# EAGLE design rpi-adapter_V0 (EAGLE 9.2.2)
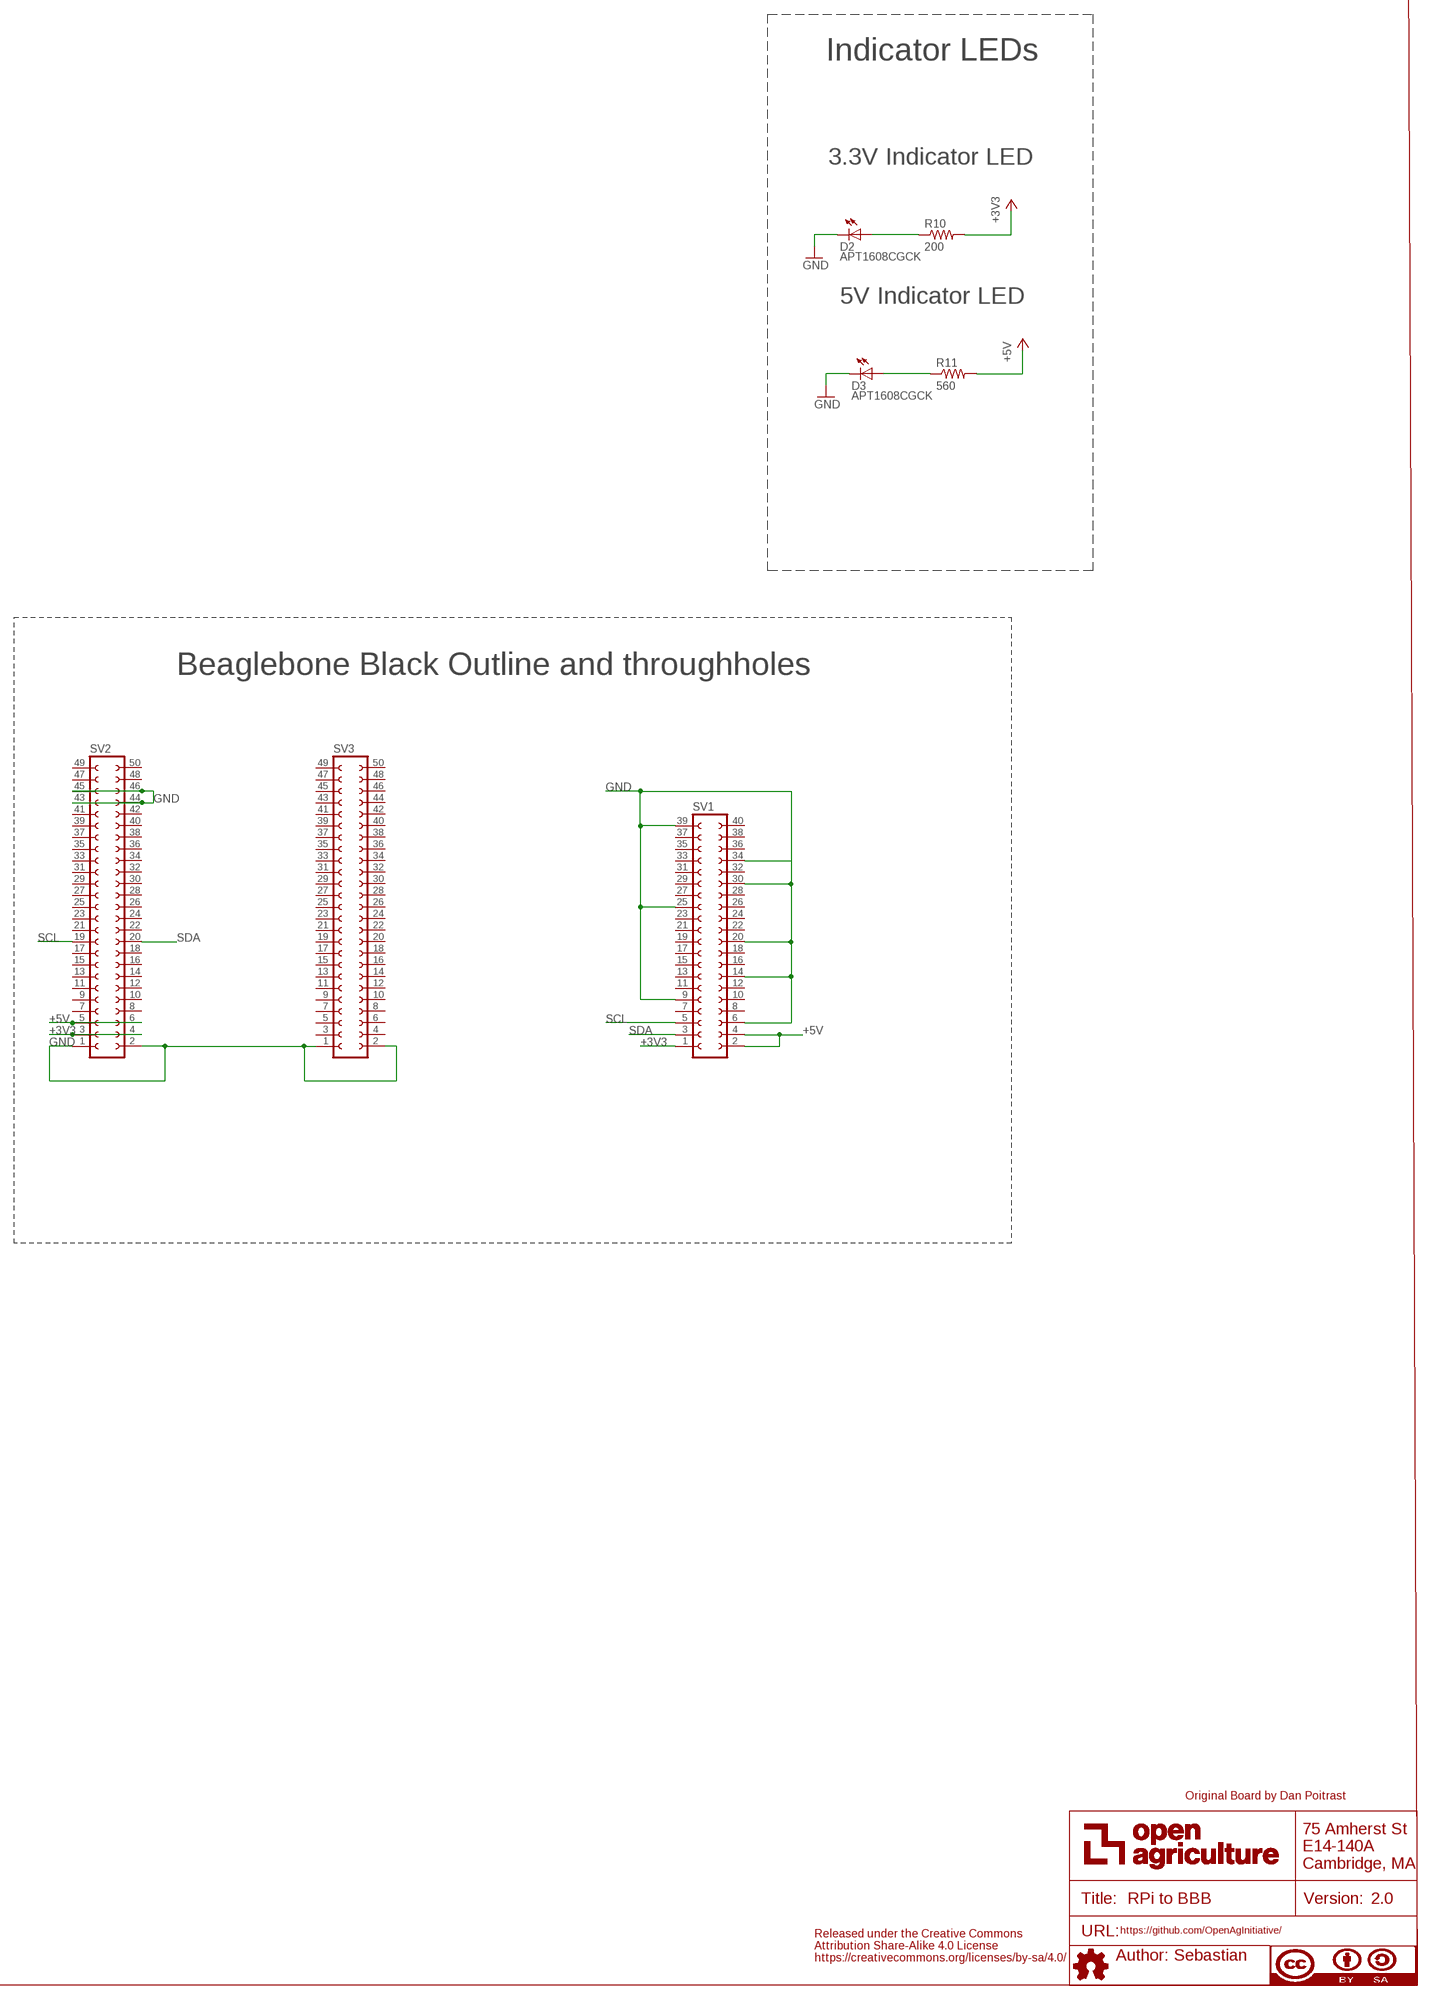
[diagram p0: schematic, sheet 1]

## Parts
ATTRIBUTES  DOCFIELD  [DOCFIELD]
D2  APT1608CGCK  [CHIPLED_0603]
D3  APT1608CGCK  [CHIPLED_0603]
R10  200  100OHM-RC0603JR-07100RL  [RC0603N]
R11  560  100OHM-RC0603JR-07100RL  [RC0603N]
SV1  FE20-2  [FE20-2]
SV2  FE25-2  [FE25-2]
SV3  FE25-2  [FE25-2]

## Nets
+3V3: R10.2 SV1.1 SV2.3 SV2.4
+5V: R11.2 SV1.2 SV1.4 SV2.5 SV2.6
GND: D2.C D3.C SV1.6 SV1.9 SV1.14 SV1.20 SV1.25 SV1.30 SV1.34 SV1.39 SV2.1 SV2.2 SV2.43 SV2.44 SV2.45 SV2.46 SV3.1 SV3.2
N$2: D3.A R11.1
N$12: D2.A R10.1
SCL: SV1.5 SV2.19
SDA: SV1.3 SV2.20
Unconnected: SV1.7 SV1.8 SV1.10 SV1.11 SV1.12 SV1.13 SV1.15 SV1.16 SV1.17 SV1.18 SV1.19 SV1.21 SV1.22 SV1.23 SV1.24 SV1.26 SV1.27 SV1.28 SV1.29 SV1.31 SV1.32 SV1.33 SV1.35 SV1.36 SV1.37 SV1.38 SV1.40 SV2.7 SV2.8 SV2.9 SV2.10 SV2.11 SV2.12 SV2.13 SV2.14 SV2.15 SV2.16 SV2.17 SV2.18 SV2.21 SV2.22 SV2.23 SV2.24 SV2.25 SV2.26 SV2.27 SV2.28 SV2.29 SV2.30 SV2.31 SV2.32 SV2.33 SV2.34 SV2.35 SV2.36 SV2.37 SV2.38 SV2.39 SV2.40 SV2.41 SV2.42 SV2.47 SV2.48 SV2.49 SV2.50 SV3.3 SV3.4 SV3.5 SV3.6 SV3.7 SV3.8 SV3.9 SV3.10 SV3.11 SV3.12 SV3.13 SV3.14 SV3.15 SV3.16 SV3.17 SV3.18 SV3.19 SV3.20 SV3.21 SV3.22 SV3.23 SV3.24 SV3.25 SV3.26 SV3.27 SV3.28 SV3.29 SV3.30 SV3.31 SV3.32 SV3.33 SV3.34 SV3.35 SV3.36 SV3.37 SV3.38 SV3.39 SV3.40 SV3.41 SV3.42 SV3.43 SV3.44 SV3.45 SV3.46 SV3.47 SV3.48 SV3.49 SV3.50

## Notes on the sheet
- Indicator LEDs
- 3.3V Indicator LED
- 5V Indicator LED
- Beaglebone Black Outline and throughholes
- Original Board by Dan Poitrast
- Released under the Creative Commons
  Attribution Share-Alike 4.0 License
  https://creativecommons.org/licenses/by-sa/4.0/

## Library data of the parts
ATTRIBUTES = openag-frames:DOCFIELD: DOCUMENT FIELD; AUTHOR: Sebastian; DESCRIPTION: RPi to BBB; TITLE: RPi to BBB; URL: https://github.com/OpenAgInitiative/; VER: 2.0
D2 D3 = openag-diodes:APT1608CGCK: Kingbright - APT1608CGCK - LED GREEN CLEAR 0603 SMD Description: Green 570nm LED Indication - Discrete 2.1V 0603 (1608 Metric) Technical Specifications: Color: Green Lens Color: Colorless Lens Transparency: Clear Millicandela Rating: 50mcd Lens Style/Size: Rectangle with Flat Top, 1.20mm x 0.80mm Voltage - Forward (Vf) (Typ): 2.1V Current - Test: 20mA Viewing Angle: 120° Mounting Type: Surface Mount Wavelength - Dominant: 570nm Wavelength - Peak: 574nm Package / Case: 0603 (1608 Metric) Supplier Device Package: Chip LED Size / Dimension: 1.60mm L x 0.80mm W Height (Max): 0.75mm Datasheet(s): APT1608CGCK <http://www.kingbrightusa.com/images/catalog/SPEC/APT1608CGCK.pdf> Vendor(s): Digikey: 754-1116-1-ND <https://www.digikey.com/product-detail/en/kingbright/APT1608CGCK/754-1116-1-ND/1747833#>; POPULATE: YES; VERIFIED: NO
R10 R11 = openag-resistors:100OHM-RC0603JR-07100RL: Yageo - RC0603JR-07100RL - RES SMD 100 OHM 5% 1/10W 0603 Description: 100 Ohms ±5% 0.1W, 1/10W Chip Resistor 0603 (1608 Metric) Moisture Resistant Thick Film Technical Specifications: Resistance: 100 Ohms Tolerance: ±5% Power (Watts): 0.1W, 1/10W Composition: Thick Film Features: Moisture Resistant Temperature Coefficient: ±100ppm/°C Operating Temperature: -55°C ~ 155°C Package / Case: 0603 (1608 Metric) Supplier Device Package: 0603 Size / Dimension: 0.063" L x 0.032" W (1.60mm x 0.80mm) Height - Seated (Max): 0.022" (0.55mm) Number of Terminations: 2 Datasheet(s): Thick Film Chip Resistor Intro <http://www.yageo.com.tw/exep/pages/download/literatures/PYu-R_INT-thick_7.pdf> Chip Resistor Marking <http://www.yageo.com/exep/pages/download/literatures/PYu-R_Marking_2.pdf> RC Series, L Datasheet <http://www.yageo.com/documents/recent/PYu-RC_Group_51_RoHS_L_8.pdf> Vendor(s): Digikey: 311-100GRCT-ND <https://www.digikey.com/product-detail/en/yageo/RC0603JR-07100RL/311-100GRCT-ND/729644>; POPULATE: YES; VALUE: 100 OHM; VERIFIED: NO
SV1 = con-lsta:FE20-2: FEMALE HEADER; OC_FARNELL: unknown; OC_NEWARK: unknown
SV2 SV3 = con-lsta:FE25-2: FEMALE HEADER; OC_FARNELL: unknown; OC_NEWARK: unknown

## Board
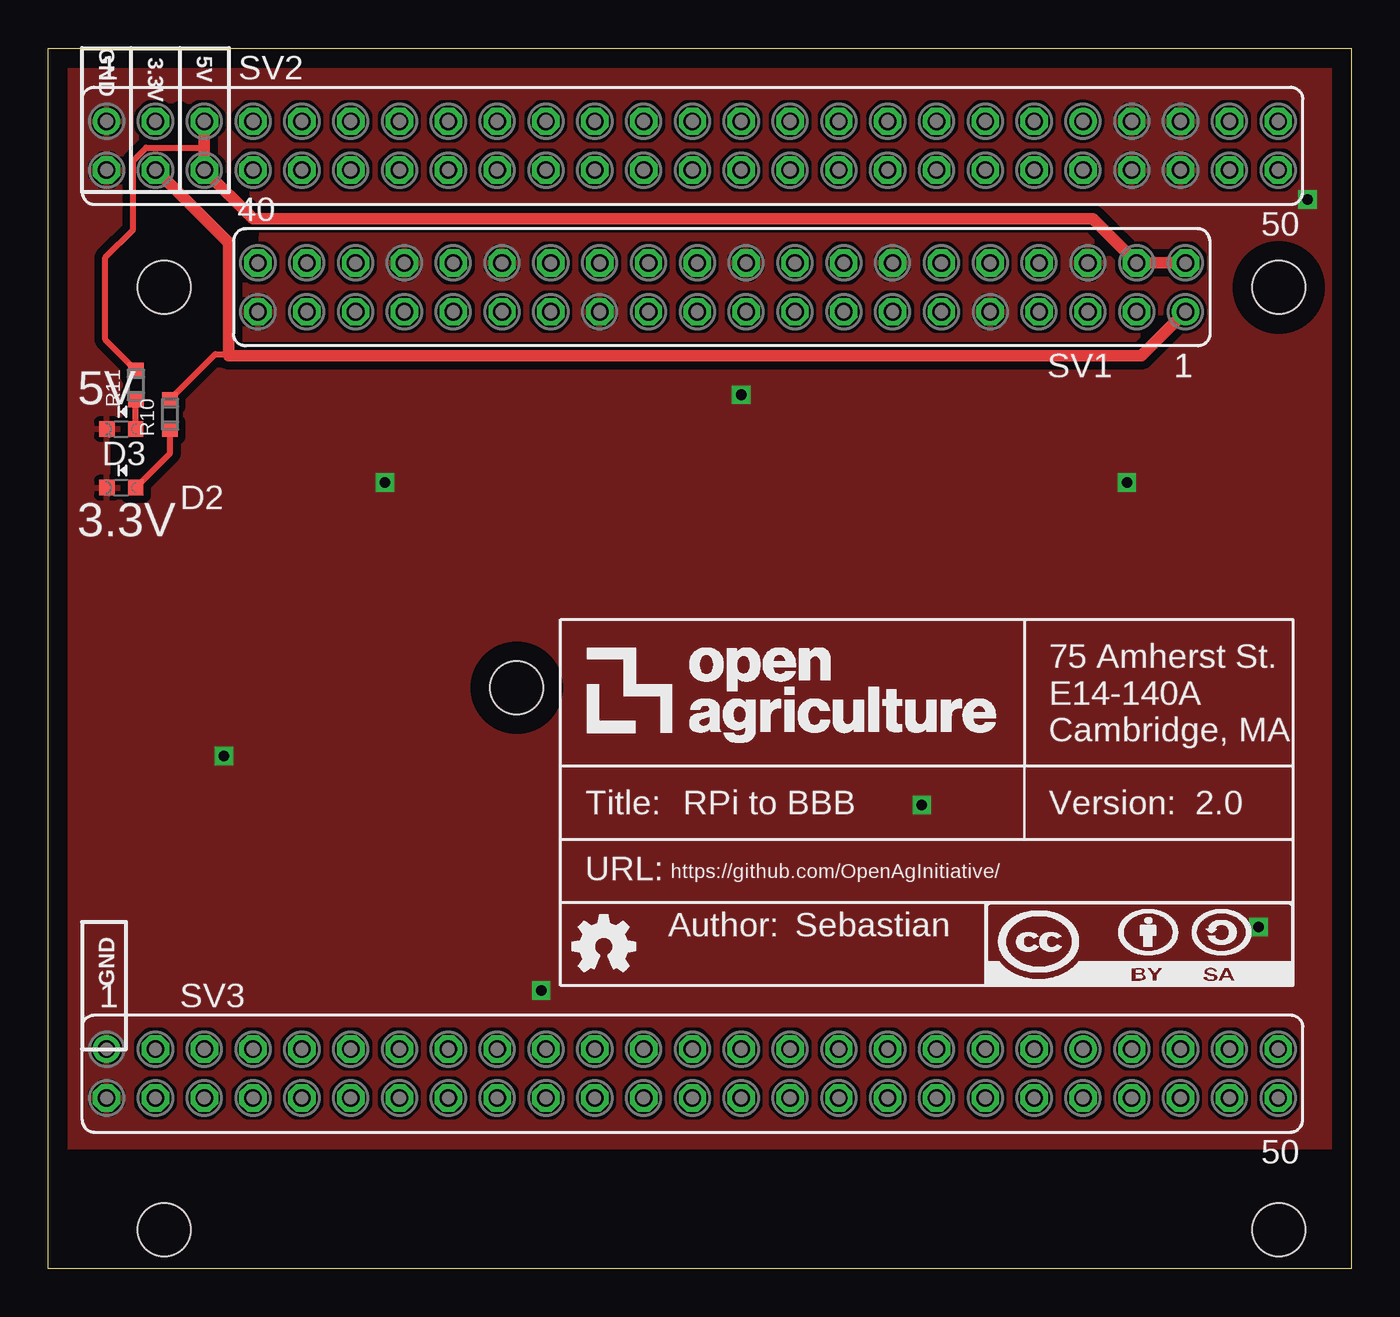
[diagram p1: board, top side]
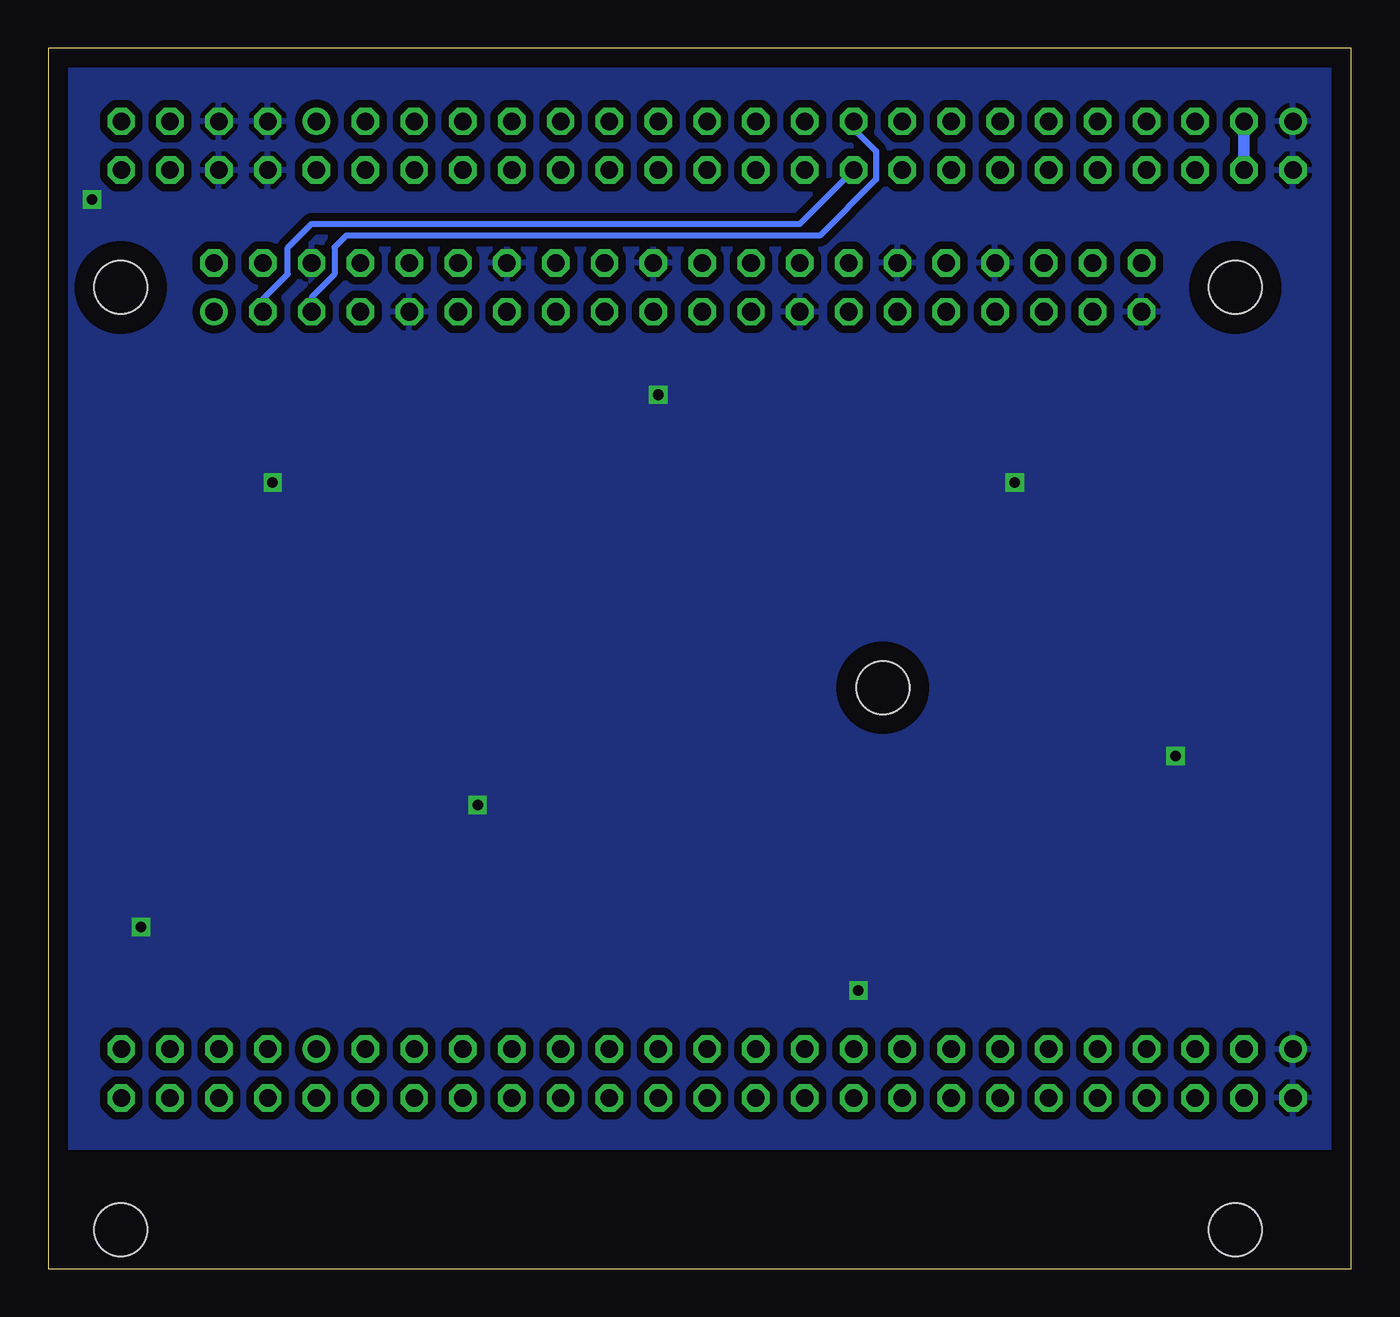
[diagram p2: board, bottom side, seen from below]

Size 67.82 x 63.5 mm. Coordinates in mm from the lower left corner, seen from the top.
Outline: 0,0 0,63.5 67.82,63.5 67.82,0 0,0
Copper layers (1*16): Top 0.035mm / dielectric 1.5mm / Bottom 0.035mm
Design rules "default *": minimum track width 6mil, minimum drill 0.35mm, track to track 12mil, track to pad 12mil, pad to pad 6mil, via to via 6mil, smd to smd 6mil, copper to edge 40mil, drill to drill 6mil, minimum pad ring 10mil, minimum via ring 8mil, stop-mask expansion 4mil, vias tented up to drill 25mil, thermal gap 10mil
Holes 2.77 mm at 6.05,51.05 64.03,51.05 6.05,2.03 64.03,2.03 24.38,30.23
tRestrict: 3 lines

### Footprints (pad centres in the part's own frame; a part is rotated, then mirrored left to right if it is on the bottom)
CHIPLED_0603 = smd 0.8 x 0.8: A 0,-0.75; C 0,0.75
RC0603N = smd 0.756 x 0.8: 1 -0.778,0; 2 0.778,0
FE20-2 = drill 0.914: 1 -24.13,1.27 | drill 0.914 octagon: 2 -24.13,-1.27; 3 -21.59,1.27; 4 -21.59,-1.27; 5 -19.05,1.27; 6 -19.05,-1.27; 7 -16.51,1.27; 8 -16.51,-1.27; 9 -13.97,1.27; 10 -13.97,-1.27; 11 -11.43,1.27; 12 -11.43,-1.27; 13 -8.89,1.27; 14 -8.89,-1.27; 15 -6.35,1.27; 16 -6.35,-1.27; 17 -3.81,1.27; 18 -3.81,-1.27; 19 -1.27,1.27; 20 -1.27,-1.27; 21 1.27,1.27; 22 1.27,-1.27; 23 3.81,1.27; 24 3.81,-1.27; 25 6.35,1.27; 26 6.35,-1.27; 27 8.89,1.27; 28 8.89,-1.27; 29 11.43,1.27; 30 11.43,-1.27; 31 13.97,1.27; 32 13.97,-1.27; 33 16.51,1.27; 34 16.51,-1.27; 35 19.05,1.27; 36 19.05,-1.27; 37 21.59,1.27; 38 21.59,-1.27; 39 24.13,1.27; 40 24.13,-1.27
FE25-2 = drill 0.914: 1 -30.48,1.27; 41 20.32,1.27 | drill 0.914 octagon: 2 -30.48,-1.27; 3 -27.94,1.27; 4 -27.94,-1.27; 5 -25.4,1.27; 6 -25.4,-1.27; 7 -22.86,1.27; 8 -22.86,-1.27; 9 -20.32,1.27; 10 -20.32,-1.27; 11 -17.78,1.27; 12 -17.78,-1.27; 13 -15.24,1.27; 14 -15.24,-1.27; 15 -12.7,1.27; 16 -12.7,-1.27; 17 -10.16,1.27; 18 -10.16,-1.27; 19 -7.62,1.27; 20 -7.62,-1.27; 21 -5.08,1.27; 22 -5.08,-1.27; 23 -2.54,1.27; 24 -2.54,-1.27; 25 0,1.27; 26 0,-1.27; 27 2.54,1.27; 28 2.54,-1.27; 29 5.08,1.27; 30 5.08,-1.27; 31 7.62,1.27; 32 7.62,-1.27; 33 10.16,1.27; 34 10.16,-1.27; 35 12.7,1.27; 36 12.7,-1.27; 37 15.24,1.27; 38 15.24,-1.27; 39 17.78,1.27; 40 17.78,-1.27; 42 20.32,-1.27; 43 22.86,1.27; 44 22.86,-1.27; 45 25.4,1.27; 46 25.4,-1.27; 47 27.94,1.27; 48 27.94,-1.27; 49 30.48,1.27; 50 30.48,-1.27

### Placement (x,y rotation side)
ATTRIBUTES  26.67,14.73 0 top
D2  3.81,40.64 90 top
D3  3.81,43.69 90 top
R10  6.35,44.45 90 top
R11  4.57,45.97 90 top
SV1  35.05,51.05 180 top
SV2  33.53,58.42 0 top
SV3  33.53,10.16 0 top

### Tracks (layer width: path | path; a pad name or v marks a point on that pad's centre or on a via)
+3V3
  Top 0.305: 11.95,47.5 12.19,47.5 | 9.4,47.58 8.7,47.58 R10.2
  Top 0.61: SV1.1 56.9,47.5 12.19,47.5 9.4,47.5 9.4,47.58 9.4,53.38 5.62,57.15 SV2.4
  Bottom 0.61: SV2.4 SV2.3
+5V
  Top 0.305: SV2.6 8.47,56.81 | 8.13,58.42 8.14,58.4 8.06,58.32 5.1,58.32 4.42,57.63 4.42,54.05 2.98,52.62 2.98,48.34 R11.2
  Top 0.61: SV1.2 SV1.4 54.36,54.61 10.67,54.61 SV2.6 8.13,58.42 SV2.5
GND  (via drill 0.55)
  other vias: 17.53,40.89 65.53,55.63 62.99,17.78 9.14,26.67 45.47,24.13 36.07,45.47 25.65,14.48 56.13,40.89
  pour Top (isolate 0.406, rank 2): 0.51,103.89 67.01,103.89 67.49,6.35 0.98,6.35 0.86,29.62
  pour Bottom (isolate 0.406, rank 2): 1.02,103.89 67.04,103.89 67.53,6.35 1.02,6.35
N$2
  Top 0.305: R11.1 4.56,45.15 D3.A
N$12
  Top 0.305: D2.A 6.35,42.43 R10.1
SCL
  Bottom 0.305: SV2.19 25.91,59.31 24.74,58.14 24.74,56.67 27.66,53.75 52.3,53.75 52.91,53.14 52.91,51.74 54.1,50.55 SV1.5
SDA
  Bottom 0.305: SV1.3 56.64,50.44 55.35,51.74 55.35,53.11 54.1,54.36 28.7,54.36 SV2.20

### Text on the board
tPlace: 5V | GND | 3.3V | 5V | 3.3V | GND